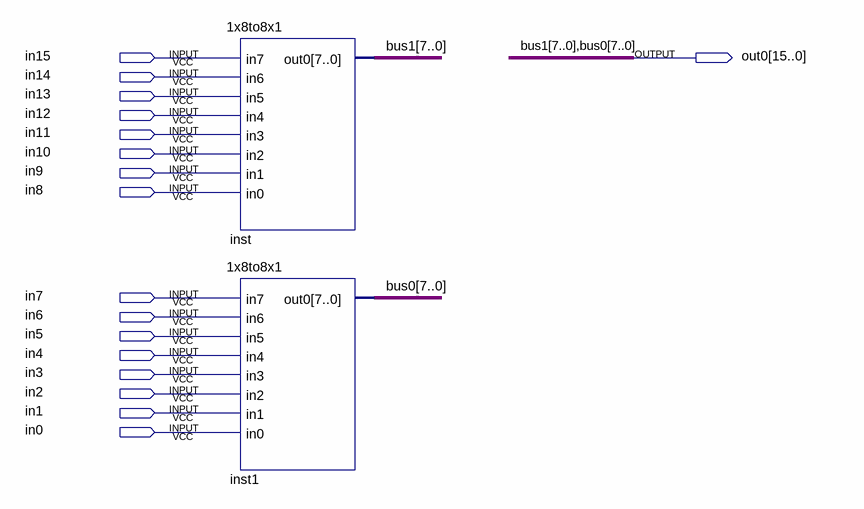
[diagram p0: schematic sheet]
// Quartus schematic 1x16to16x1.bdf as structural Verilog: 2 symbols, 17 pins
module \1x16to16x1  (
  input  in15,
  input  in14,
  input  in13,
  input  in12,
  input  in11,
  input  in10,
  input  in9,
  input  in8,
  input  in7,
  input  in6,
  input  in5,
  input  in4,
  input  in3,
  input  in2,
  input  in1,
  input  in0,
  output [15:0] out0
);

  \1x8to8x1  inst (
    .in7(in15), .in6(in14), .in5(in13), .in4(in12), .in3(in11), .in2(in10), .in1(in9), .in0(in8),
    .out0(out0[15:8]));
  \1x8to8x1  inst1 (
    .in7(in7), .in6(in6), .in5(in5), .in4(in4), .in3(in3), .in2(in2), .in1(in1), .in0(in0), .out0(out0[7:0]));

  // Other names for the same wires on the sheet: bus0[7:0] = out0[7:0]; bus1[7:0] = out0[15:8]
endmodule
